# Altium project dc_power_module_v1.PrjPcb
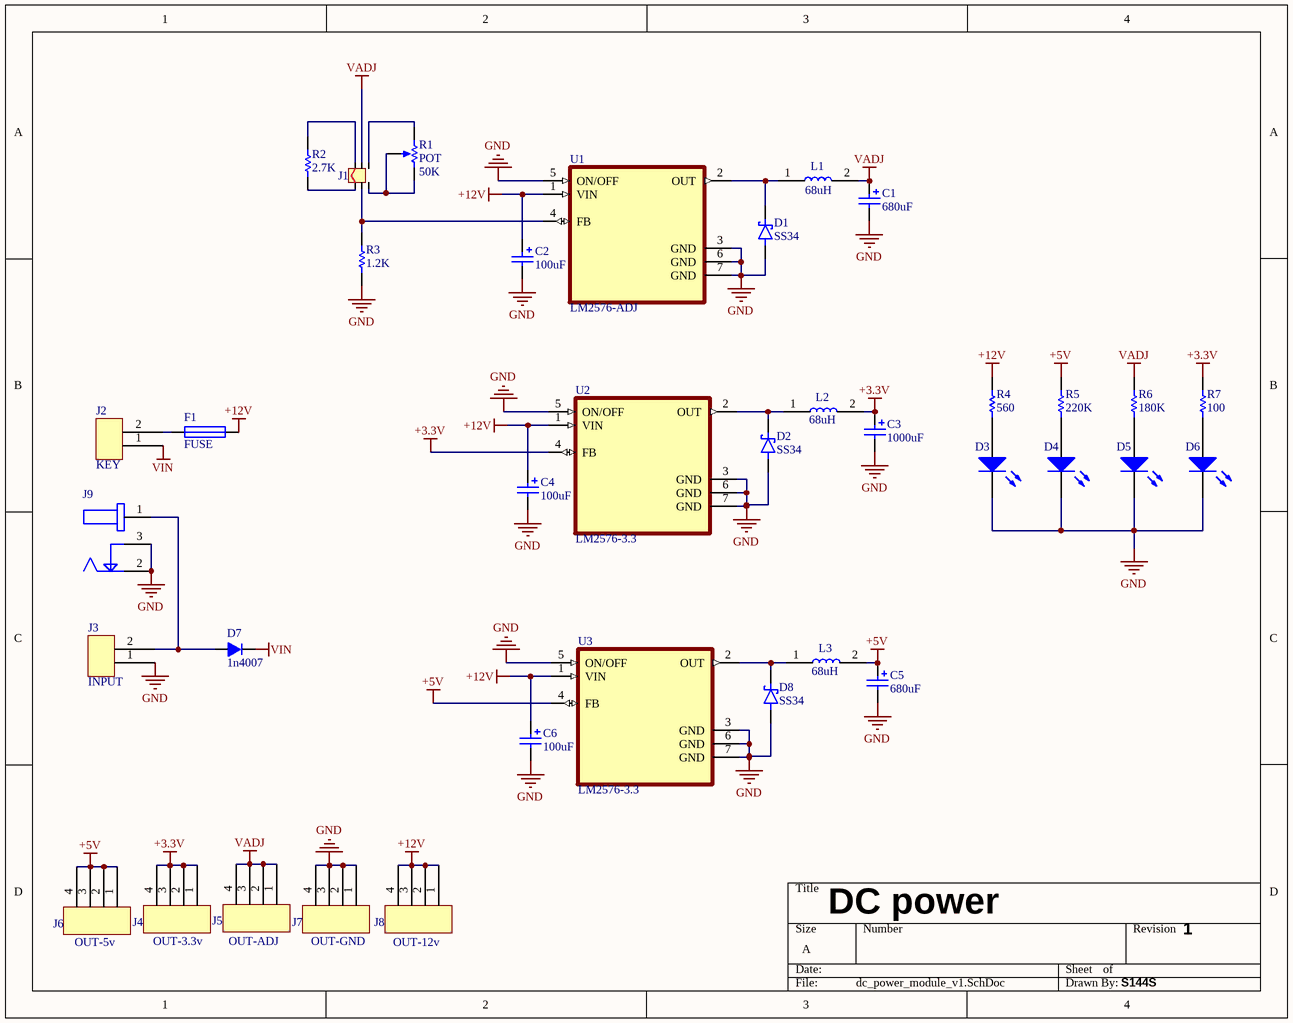
[diagram p0: dc_power_module_v1.SchDoc]
1 sheet, 37 parts. Net scope: global (net labels, ports and power ports of the same name join across sheets).
Board file: dc_power_module_v1.PcbDoc

## Sheet dc_power_module_v1.SchDoc
size A

### Parts
C1  value 680uF  [Cap 03]  (hidden comment: Cap Pol2)
C2  value 100uF  [Cap - 470uF]  (hidden comment: Cap Pol2)
C3  value 1000uF  [Cap 04]  (hidden comment: Cap Pol2)
C4  value 100uF  [Cap - 470uF]  (hidden comment: Cap Pol2)
C5  value 680uF  [Cap 03]  (hidden comment: Cap Pol2)
C6  value 100uF  [Cap - 470uF]  (hidden comment: Cap Pol2)
D1  SS34  [DIOM7959X262N]
D2  SS34  [DIOM7959X262N]
D3  LED1  [LED SMD 1206]  (value not drawn)
D4  LED1  [LED SMD 1206]  (value not drawn)
D5  LED1  [LED SMD 1206]  (value not drawn)
D6  LED1  [LED SMD 1206]  (value not drawn)
D7  1n4007  [DIODE_4001]
D8  SS34  [DIOM7959X262N]
F1  FUSE  [Fuse - Complex]
J1  JUMPER6  [JUMP6]  (value not drawn)
J2  KEY  [SIP2]
J3  INPUT  [SIP2]
J4  OUT-3.3v  [SIP4]
J5  OUT-ADJ  [SIP4]
J6  OUT-5v  [SIP4]
J7  OUT-GND  [SIP4]
J8  OUT-12v  [SIP4]
J9  DCJ250-10-A_XX-X_REVA  [Power Jack]  (value not drawn)
L1  68uH  [*IND_SRP1265A-330M]
L2  68uH  [*IND_SRP1265A-330M]
L3  68uH  [*IND_SRP1265A-330M]
R1  POT  value 50K  [Pot 00]
R2  value 2.7K  [RES 1206]  (hidden comment: Res-1206)
R3  value 1.2K  [RES 1206]  (hidden comment: Res-1206)
R4  value 560  [RES 1206]  (hidden comment: Res-1206)
R5  value 220K  [RES 1206]  (hidden comment: Res-1206)
R6  value 180K  [RES 1206]  (hidden comment: Res-1206)
R7  value 100  [RES 1206]  (hidden comment: Res-1206)
U1  LM2576-ADJ  [VREG_TPS79625KTTR]
U2  LM2576-3.3  [VREG_TPS79625KTTR]
U3  LM2576-3.3  [VREG_TPS79625KTTR]

### Nets
+3.3V: C3.1 J4.1 J4.2 J4.3 J4.4 L2.2 R7.2 U2.4(FB)
+5V: C5.1 J6.1 J6.2 J6.3 J6.4 L3.2 R5.2 U3.4(FB)
+12V: C2.1 C4.1 C6.1 F1.2 J8.1 J8.2 J8.3 J8.4 R4.2 U1.1(VIN) U2.1(VIN) U3.1(VIN)
GND: C1.2 C2.2 C3.2 C4.2 C5.2 C6.2 D1.A D2.A D3.2(K) D4.2(K) D5.2(K) D6.2(K) D8.A J3.1 J7.1 J7.2 J7.3 J7.4 J9.2 J9.3 R3.1 U1.3(GND) U1.5(ON/OFF) U1.6(GND) U1.7(GND) U2.3(GND) U2.5(ON/OFF) U2.6(GND) U2.7(GND) U3.3(GND) U3.5(ON/OFF) U3.6(GND) U3.7(GND)
VADJ: C1.1 J1.4 J5.1 J5.2 J5.3 J5.4 L1.2 R6.2
VIN: D7.2(K) J2.1
NetD1_C: D1.C L1.1 U1.2(OUT)
NetD2_C: D2.C L2.1 U2.2(OUT)
NetD3_1: D3.1(A) R4.1
NetD4_1: D4.1(A) R5.1
NetD5_1: D5.1(A) R6.1
NetD6_1: D6.1(A) R7.1
NetD7_1: D7.1(A) J3.2 J9.1
NetD8_C: D8.C L3.1 U3.2(OUT)
NetF1_1: F1.1 J2.2
NetJ1_1: J1.1 R2.1
NetJ1_2: J1.2 R2.2
NetJ1_3: J1.3 R3.2 U1.4(FB)
NetJ1_5: J1.5 R1.2(BOT) R1.3(TAP)
NetJ1_6: J1.6 R1.1(TOP)

### Notes on the sheet
- DC power
- 1
- S144S

### Library data of the parts
C1-C6 = Cap Pol2: Polarized Capacitor (Axial); Published: 8-Jun-2000; LatestRevisionDate: 17-Jul-2002; LatestRevisionNote: Re-released for DXP Platform.; PackageReference: POLAR0.8; Publisher: Altium Limited; PackageDescription: Polarized Capacitor; 2 Leads
D1 D2 D8 = SS34-E3/57T: Diode Schottky 40V 3A Surface Mount DO-214AB _SMC_; MF: Vishay; MP: SS34-E3/57T; Availability: Unavailable; SnapEDA_Link: https://www.snapeda.com/parts/SS34-E3/57T/Vishay%20Semiconductor%20Diodes%20Division/view-part/104253/?ref=snap; Package: DO-214 Vishay; Value: *; Price: None
D3-D6 = LED1: Typical RED GaAs LED; Published: 8-Jun-2000; LatestRevisionDate: 08-Jul-2005; LatestRevisionNote: Mech Layer 1 removed.; PackageReference: LED-1; Publisher: Altium Limited; PackageDescription: LED; 2 Leads
D7 = DIOD: Rectifire Diode
J1 = JUMPER6: Ju,per & dip Switch
J2 J3 = 2PIN
J4-J8 = 4PIN
J9 = DCJ250-10-A_XX-X_REVA: Power Barrel Connector Jack 2.55mm ID _0.100_, 5.50mm OD _0.217_ Through Hole, Right Angle; MP: DCJ250-10-A-K1-K; MF: Global Connector Technology; Availability: Unavailable; Package: None; Value: *; Price: None; SnapEDA_Link: https://www.snapeda.com/parts/DCJ250-10-A-K1-K/Global%20Connector%20Technology/view-part/813036/?ref=snap
L1-L3 = SRP1265A-330M: Inductor Power Shielded Wirewound 33uH 20% 100KHz Carbonyl Powder 8A 58mOhm DCR Automotive T/R; MF: Bourns; Package: 1008 Bourns; MP: SRP1265A-330M; Price: None; Availability: Unavailable; SnapEDA_Link: https://www.snapeda.com/parts/SRP1265A-330M/Bourns/view-part/?ref=snap; Value: *
R1 = RPot: Volume Potentiometer; Sim Note: Enter the Resistance value and the set point into parameter fields.; Set Position: 0.5; Published: 8-Jun-2000; LatestRevisionDate: 17-Jul-2002; LatestRevisionNote: Re-released for DXP Platform.; PackageReference: VR5; Publisher: Altium Limited; PackageDescription: Variable Resistor, Thru-Hole; 3 Leads
R2-R7 = Res-1206: Resistor; Published: 8-Jun-2000; LatestRevisionDate: 17-Jul-2002; LatestRevisionNote: Re-released for DXP Platform.; PackageReference: AXIAL-0.3; Publisher: Altium Limited; PackageDescription: Axial Device, Thru-Hole; 2 Leads; 0.3 in Pin Spacing
U1-U3 = LM2576HVS-ADJ/NOPB: SWITCHER Ø³Ø§Ø¯Ù‡ Ùˆ regØ› ØªÙ†Ø¸ÛŒÙ… Ú©Ù†Ù†Ø¯Ù‡ Ú¯Ø§Ù… Ø¨Ù‡ Ù¾Ø§ÛŒÛŒÙ† ØªØ¹Ø¯Ø§Ø¯ 4 ÙˆÙ„Øª ØªØ§ 60 ÙˆÙ„Øª ØŒ 3A Ú©Ù… Ú©Ø§Ù…Ù¾ÙˆÙ†Ù†Øª 5-DDPAK / TO-263 -40 ØªØ§ 125; MF: Texas Instruments; SnapEDA_Link: https://www.snapeda.com/parts/LM2576HVS-ADJ/NOPB/Texas%20Instruments/view-part/213619/?ref=snap; Package: TO-263-5 Texas Instruments; Availability: Unavailable; Price: None; Value: *; MP: LM2576HVS-ADJ/NOPB; Texas_Instruments-Purchase-URL: https://snapeda.com/shop?store=Texas+Instruments&id=213619; BuyPart: https://www.snapeda.com/parts/LM2576HVS-ADJ/NOPB/Texas%20Instruments/view-part/213619/?ref=eda